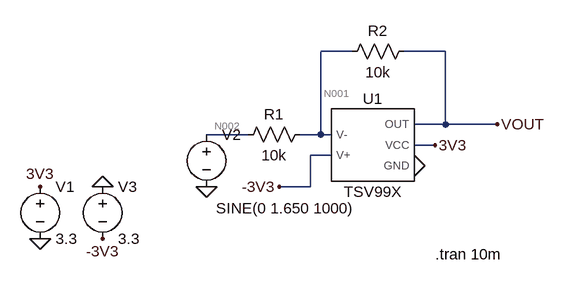
[diagram p0: schematic non inverting TSV991.asc]
non inverting TSV991.asc, the LTspice schematic file:
Version 4
SHEET 1 880 680
WIRE 144 0 96 0
WIRE 288 0 224 0
WIRE 288 112 288 0
WIRE 288 112 240 112
WIRE 368 112 288 112
WIRE -16 128 -80 128
WIRE 96 128 96 0
WIRE 96 128 64 128
WIRE 112 128 96 128
WIRE 272 144 240 144
WIRE 112 160 80 160
WIRE 80 208 80 160
WIRE 80 208 32 208
FLAG 240 176 0
FLAG -336 288 0
FLAG -336 208 3V3
FLAG 272 144 3V3
FLAG 368 112 VOUT
FLAG -80 208 0
FLAG 32 208 -3V3
FLAG -240 208 0
FLAG -240 288 -3V3
SYMBOL AutoGenerated\\TSV99X 176 144 R0
SYMATTR InstName U1
SYMBOL voltage -336 192 R0
WINDOW 123 0 0 Left 2
WINDOW 39 0 0 Left 2
SYMATTR InstName V1
SYMATTR Value 3.3
SYMBOL res -32 144 R270
WINDOW 0 32 56 VTop 2
WINDOW 3 0 56 VBottom 2
SYMATTR InstName R1
SYMATTR Value 10k
SYMBOL res 128 16 R270
WINDOW 0 32 56 VTop 2
WINDOW 3 0 56 VBottom 2
SYMATTR InstName R2
SYMATTR Value 10k
SYMBOL voltage -80 112 R0
WINDOW 3 15 129 Left 2
WINDOW 123 0 0 Left 2
WINDOW 39 0 0 Left 2
SYMATTR InstName V2
SYMATTR Value SINE(0 1.650 1000)
SYMBOL voltage -240 192 R0
WINDOW 123 0 0 Left 2
WINDOW 39 0 0 Left 2
SYMATTR InstName V3
SYMATTR Value 3.3
TEXT 272 312 Left 2 !.tran 10m

The netlist it stands for:
* non inverting TSV991.asc
XU1 N001 -3V3 VOUT 3V3 0 TSV99X  ; pins V- V+ OUT VCC GND
V1 3V3 0 3.3
R1 N002 N001 10k
R2 N001 VOUT 10k
V2 N002 0 SINE(0 1.650 1000)
V3 0 -3V3 3.3
.tran 10m
.lib D:\Github\LTSpice\LTS0000 - Models\TSX631.mod
.backanno
.end

* Results of the author's LTspice run, read from the files saved beside the schematic
* Operating Point, zero values left out:
*   V(n001) = 16.59 mV
*   V(vout) = 15.37 mV
*   V(-3v3) = -3.3 V
*   V(3v3) = 3.3 V
*   I(R2) = 121.6 nA
*   I(R1) = -1.659 µA
*   I(V3) = -214.6 µA
*   I(V2) = 1.659 µA
*   I(V1) = -3 mA
*   Ix(u1:VM) = -1.781 µA
*   Ix(u1:VP) = -214.6 µA
*   Ix(u1:VS) = 121.6 nA
*   Ix(u1:VCCP) = 3 mA
*   Ix(u1:VCCN) = -2.784 mA
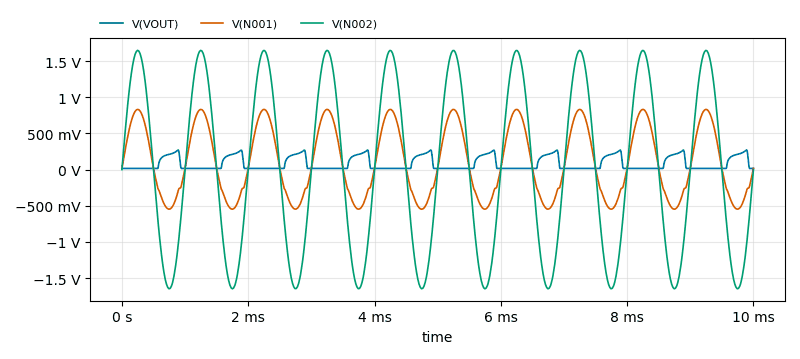
[diagram p1: Transient Analysis of non inverting TSV991.asc, plotted from the saved traces]
* Transient Analysis, 1 run:
*   V(VOUT): min 15.18 mV, max 272.2 mV, average 80.49 mV, rms 122.1 mV, last 15.37 mV
*   V(N001): min -548 mV, max 832.3 mV, average 94.68 mV, rms 496.5 mV, last 16.45 mV
*   V(N002): min -1.648 V, max 1.648 V, average -260.5 µV, rms 1.165 V, last 0 V